# EAGLE design Trigger_Sequencer_Arduino_board (EAGLE 9.2.2)
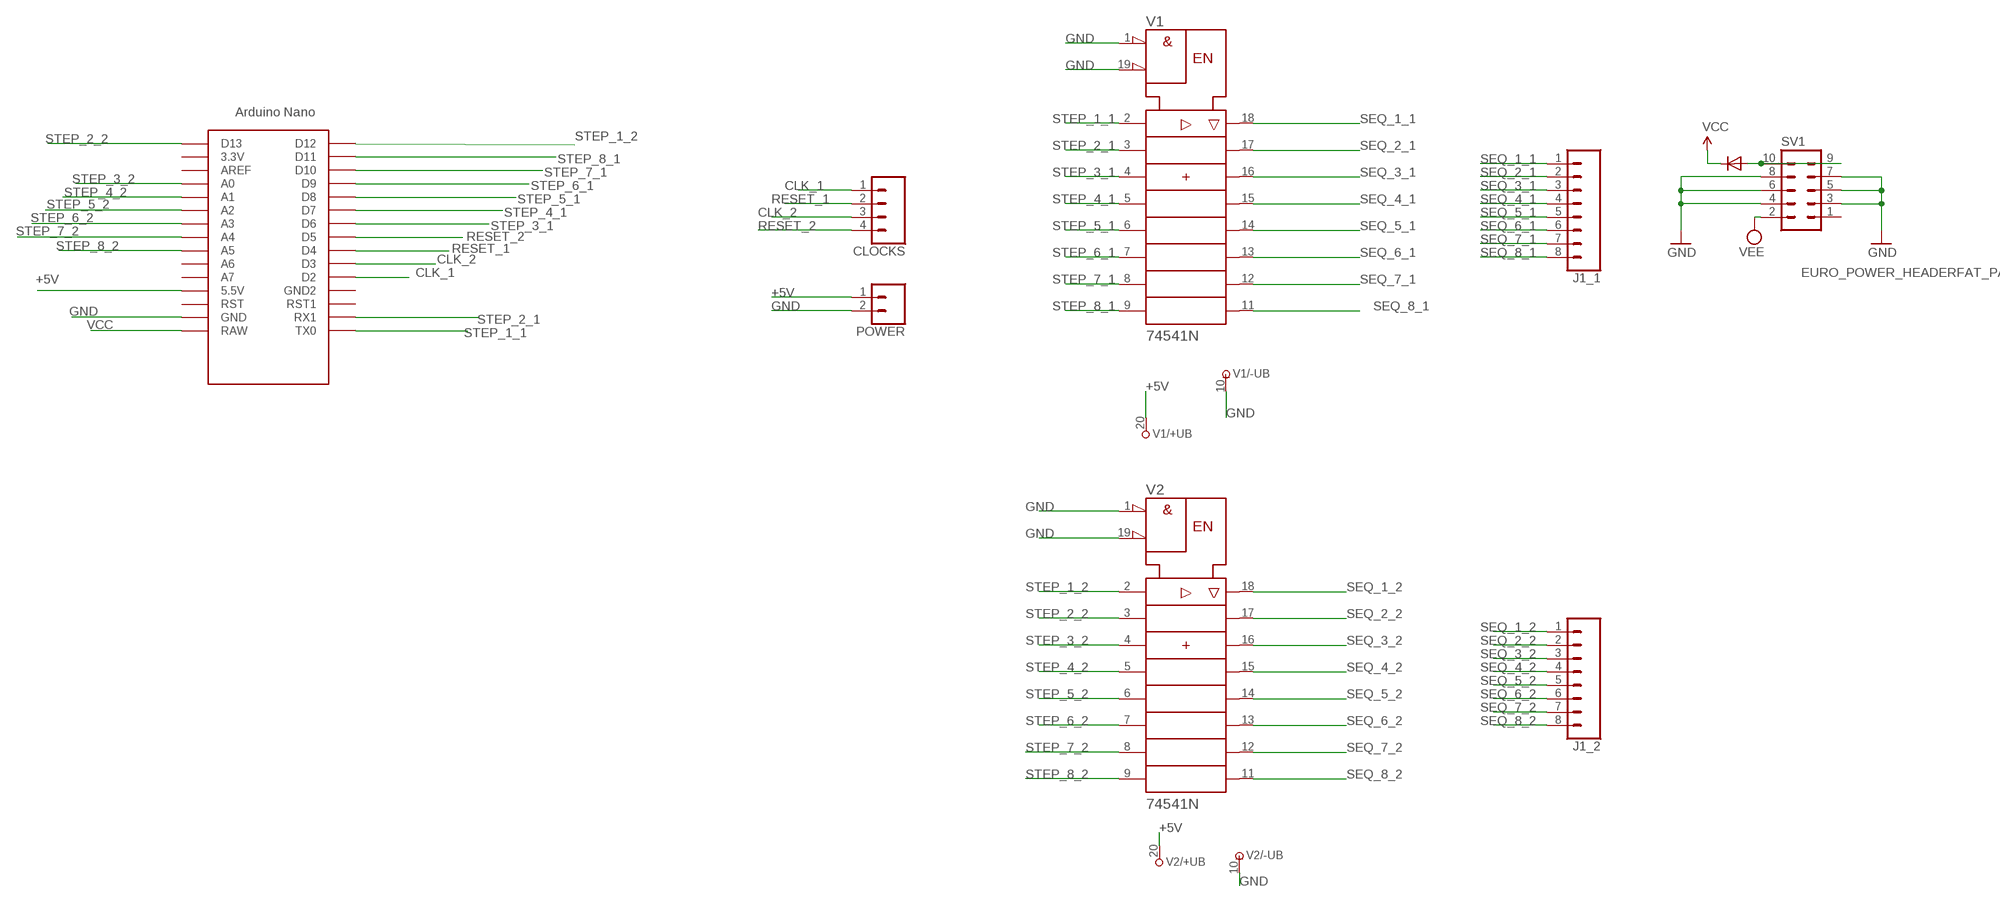
[diagram p0: schematic, sheet 1]

## Parts
CLOCKS  CONN_04  [1X04]
D2  1N5819HW  DIODEDO-1N4148  [DO-1N4148]
J1_1  CONN_08NO_SILK_FEMALE_PTH  [1X08_NO_SILK]
J1_2  CONN_08NO_SILK_FEMALE_PTH  [1X08_NO_SILK]
POWER  CONN_02  [1X02]
SV1  EURO_POWER_HEADERFAT_PADS  [EURO_PWR_HEADER_FAT]
U$1  NANO  [NANO]
V1  74541N  [DIL20]
V2  74541N  [DIL20]

## Nets
+5V: POWER.1 U$1.5V(5.5V) V1.20(+UB) V2.20(+UB)
CLK_1: CLOCKS.1 U$1.D2
CLK_2: CLOCKS.3 U$1.D3
GND: POWER.2 SV1.3 SV1.4 SV1.5 SV1.6 SV1.7 SV1.8 U$1.GND V1.1(!G1) V1.10(-UB) V1.19(!G2) V2.1(!G1) V2.10(-UB) V2.19(!G2)
N$1: D2.A SV1.9 SV1.10
RESET_1: CLOCKS.2 U$1.D4
RESET_2: CLOCKS.4 U$1.D5
SEQ_1_1: J1_1.1 V1.18(Y1)
SEQ_1_2: J1_2.1 V2.18(Y1)
SEQ_2_1: J1_1.2 V1.17(Y2)
SEQ_2_2: J1_2.2 V2.17(Y2)
SEQ_3_1: J1_1.3 V1.16(Y3)
SEQ_3_2: J1_2.3 V2.16(Y3)
SEQ_4_1: J1_1.4 V1.15(Y4)
SEQ_4_2: J1_2.4 V2.15(Y4)
SEQ_5_1: J1_1.5 V1.14(Y5)
SEQ_5_2: J1_2.5 V2.14(Y5)
SEQ_6_1: J1_1.6 V1.13(Y6)
SEQ_6_2: J1_2.6 V2.13(Y6)
SEQ_7_1: J1_1.7 V1.12(Y7)
SEQ_7_2: J1_2.7 V2.12(Y7)
SEQ_8_1: J1_1.8 V1.11(Y8)
SEQ_8_2: J1_2.8 V2.11(Y8)
STEP_1_1: U$1.TX0 V1.2(A1)
STEP_1_2: U$1.D12 V2.2(A1)
STEP_2_1: U$1.RX1 V1.3(A2)
STEP_2_2: U$1.D13 V2.3(A2)
STEP_3_1: U$1.D6 V1.4(A3)
STEP_3_2: U$1.A0 V2.4(A3)
STEP_4_1: U$1.D7 V1.5(A4)
STEP_4_2: U$1.A1 V2.5(A4)
STEP_5_1: U$1.D8 V1.6(A5)
STEP_5_2: U$1.A2 V2.6(A5)
STEP_6_1: U$1.D9 V1.7(A6)
STEP_6_2: U$1.A3 V2.7(A6)
STEP_7_1: U$1.D10 V1.8(A7)
STEP_7_2: U$1.A4 V2.8(A7)
STEP_8_1: U$1.D11 V1.9(A8)
STEP_8_2: U$1.A5 V2.9(A8)
VCC: D2.C U$1.RAW
VEE: SV1.2
Unconnected: SV1.1 U$1.3.3V U$1.A6 U$1.A7 U$1.AREF U$1.GND1(GND2) U$1.RST U$1.RST1

## Library data of the parts
CLOCKS = SparkFun-Connectors:CONN_04: Multi connection point. Often used as Generic Header-pin footprint for 0.1 inch spaced/style header connections On any of the 0.1 inch spaced packages, you can populate with these: Break Away Headers - Straight <https://www.sparkfun.com/products/116> (PRT-00116) Break Away Male Headers - Right Angle <https://www.sparkfun.com/products/553> (PRT-00553) Female Headers <https://www.sparkfun.com/products/115> (PRT-00115) Break Away Headers - Machine Pin <https://www.sparkfun.com/products/117> (PRT-00117) Break Away Female Headers - Swiss Machine Pin <https://www.sparkfun.com/products/743> (PRT-00743) For SCREWTERMINALS and SPRING TERMINALS visit here: Screw Terimnals on SparkFun.com <https://www.sparkfun.com/search/results?term=Screw+Terminals> (5mm/3.5mm/2.54mm spacing) This device is also useful as a general connection point to wire up your design to another part of your project. Our various solder wires solder well into these plated through hole pads. Hook-Up Wire - Assortment (Stranded, 22 AWG) <https://www.sparkfun.com/products/11375> (PRT-11375) Hook-Up Wire - Assortment (Solid Core, 22 AWG) <https://www.sparkfun.com/products/11367> (PRT-11367) View the entire wire category on our website here <https://www.sparkfun.com/categories/141> Special notes: Molex polarized connector foot print use with SKU : PRT-08231 with associated crimp pins and housings. 1MM SMD Version SKU: PRT-10208; PROD_ID: CONN-09696
D2 = adafruit:DIODE: Diode SMADIODE - SMA Surface Mount Package 20V 1A Schottky Diode Digikey: 641-1014-6-ND DO-1N4148 - Through Hole Small Current Diode SOD-123 20V 1 A (.5mV Vf) Schottky Diode - Digikey: MBRX120TPMSCT-ND SOD-323 10V 570mA (.38mV Vf, 3ns) Schottky Diode - Digikey: ZLLS410CT-ND SOD-523 30V 30mA Schottky Diode (RB751S-40TE61) - Digikey: RB751S-40TE61CT-ND SOT23-R/W - SOT23 Package (R = Solder Paste/Reflow Ovens, W = Hand-Soldering) BAT54Film 40V 300mA - Digikey: 497-7162-1-ND
J1_1 J1_2 = SparkFun-Connectors:CONN_08: Multi connection point. Often used as Generic Header-pin footprint for 0.1 inch spaced/style header connections On any of the 0.1 inch spaced packages, you can populate with these: Break Away Headers - Straight <https://www.sparkfun.com/products/116> (PRT-00116) Break Away Male Headers - Right Angle <https://www.sparkfun.com/products/553> (PRT-00553) Female Headers <https://www.sparkfun.com/products/115> (PRT-00115) Break Away Headers - Machine Pin <https://www.sparkfun.com/products/117> (PRT-00117) Break Away Female Headers - Swiss Machine Pin <https://www.sparkfun.com/products/743> (PRT-00743) Arduino Stackable Header - 8 Pin <https://www.sparkfun.com/products/9279> (PRT-09279) For SCREWTERMINALS and SPRING TERMINALS visit here: Screw Terimnals on SparkFun.com <https://www.sparkfun.com/search/results?term=Screw+Terminals> (5mm/3.5mm/2.54mm spacing) This device is also useful as a general connection point to wire up your design to another part of your project. Our various solder wires solder well into these plated through hole pads. Hook-Up Wire - Assortment (Stranded, 22 AWG) <https://www.sparkfun.com/products/11375> (PRT-11375) Hook-Up Wire - Assortment (Solid Core, 22 AWG) <https://www.sparkfun.com/products/11367> (PRT-11367) View the entire wire category on our website here <https://www.sparkfun.com/categories/141> Special notes: Molex polarized connector foot print use with SKU : PRT-08231 with associated crimp pins and housings. 1MM SMD Version SKU: PRT-10208 NOTES ON THE VARIANTS LOCK and LOCK_LONGPADS... This footprint was designed to help hold the alignment of a through-hole component (i.e. 6-pin header) while soldering it into place. You may notice that each hole has been shifted either up or down by 0.005 of an inch from it's more standard position (which is a perfectly straight line). This slight alteration caused the pins (the squares in the middle) to touch the edges of the holes. Because they are alternating, it causes a "brace" to hold the component in place. 0.005 has proven to be the perfect amount of "off-center" position when using our standard breakaway headers. Although looks a little odd when you look at the bare footprint, once you have a header in there, the alteration is very hard to notice. Also,if you push a header all the way into place, it is covered up entirely on the bottom side.; PROD_ID: CONN-08438
POWER = SparkFun-Connectors:CONN_02: Multi connection point. Often used as Generic Header-pin footprint for 0.1 inch spaced/style header connections On any of the 0.1 inch spaced packages, you can populate with these: Break Away Headers - Straight <https://www.sparkfun.com/products/116> (PRT-00116) Break Away Male Headers - Right Angle <https://www.sparkfun.com/products/553> (PRT-00553) Female Headers <https://www.sparkfun.com/products/115> (PRT-00115) Break Away Headers - Machine Pin <https://www.sparkfun.com/products/117> (PRT-00117) Break Away Female Headers - Swiss Machine Pin <https://www.sparkfun.com/products/743> (PRT-00743) For SCREWTERMINALS and SPRING TERMINALS visit here: Screw Terimnals on SparkFun.com <https://www.sparkfun.com/search/results?term=Screw+Terminals> (5mm/3.5mm/2.54mm spacing) This device is also useful as a general connection point to wire up your design to another part of your project. Our various solder wires solder well into these plated through hole pads. Hook-Up Wire - Assortment (Stranded, 22 AWG) <https://www.sparkfun.com/products/11375> (PRT-11375) Hook-Up Wire - Assortment (Solid Core, 22 AWG) <https://www.sparkfun.com/products/11367> (PRT-11367) View the entire wire category on our website here <https://www.sparkfun.com/categories/141> Special notes: Molex polarized connector foot print use with: PRT-08233 with associated crimp pins and housings. 2.54_SCREWTERM for use with PRT-10571. 3.5mm Screw Terminal footprints for PRT-08084 5mm Screw Terminal footprints for use with PRT-08432
SV1 = MusicThingModular:EURO_POWER_HEADER: Power Header 10 pin power header for Eurorack Power Supplies Variants with fatter pads for easier soldering, and the LOCK variant which has 5mil offset pins to hold the component in place before soldering
U$1 = Arduino-clone_EDITED_coordinates:NANO: Arduino Nano
V1 V2 = 74ttl-din:74*541: Octal BUFFER and LINE DRIVER, 3-state

## Board
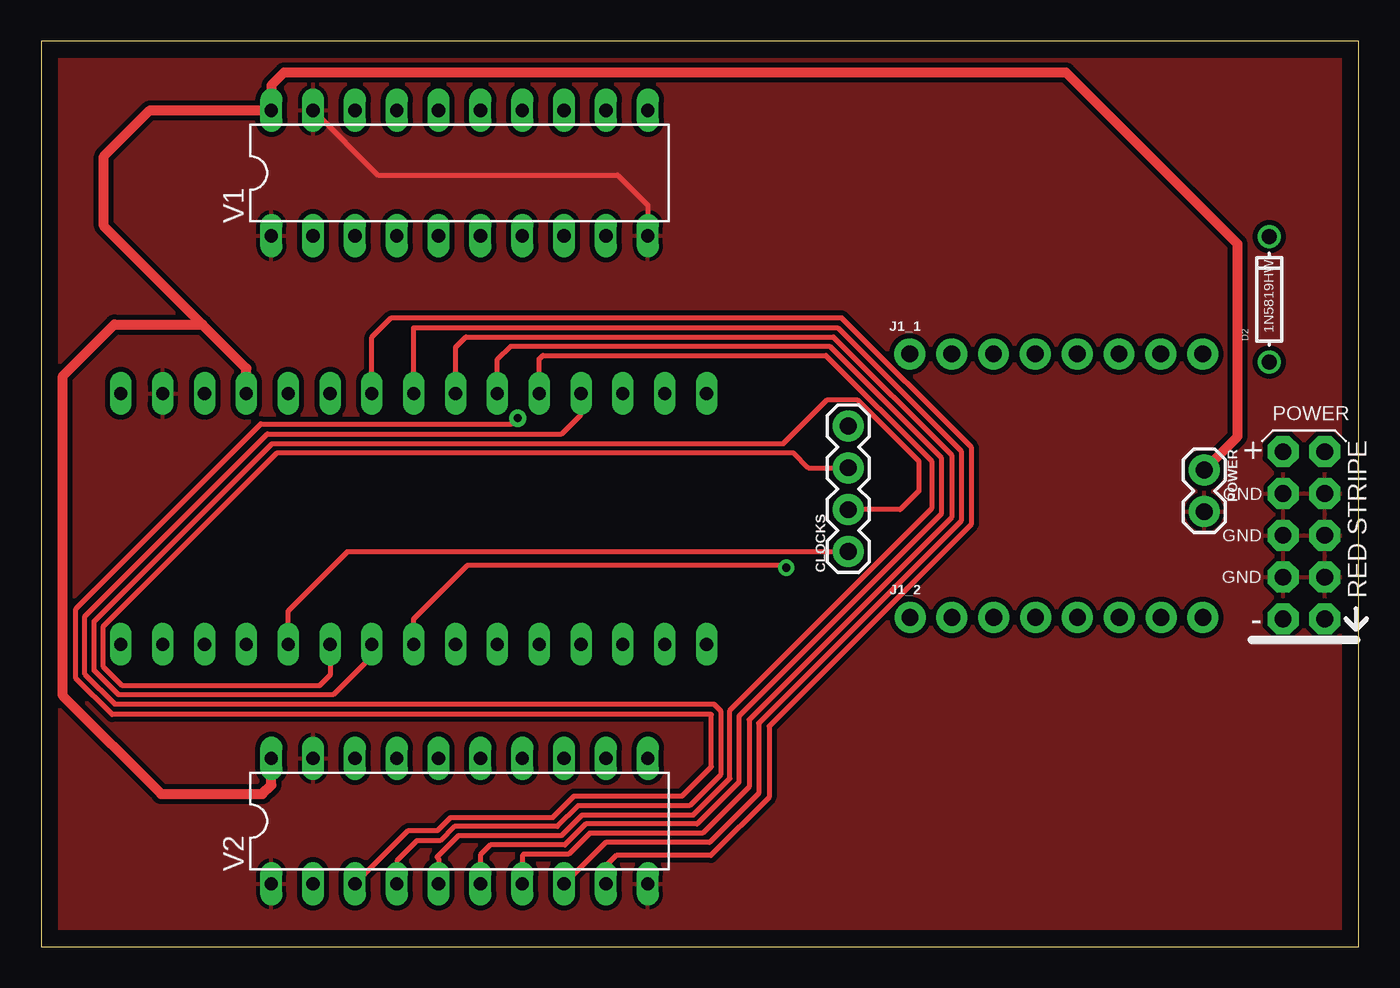
[diagram p1: board, top side]
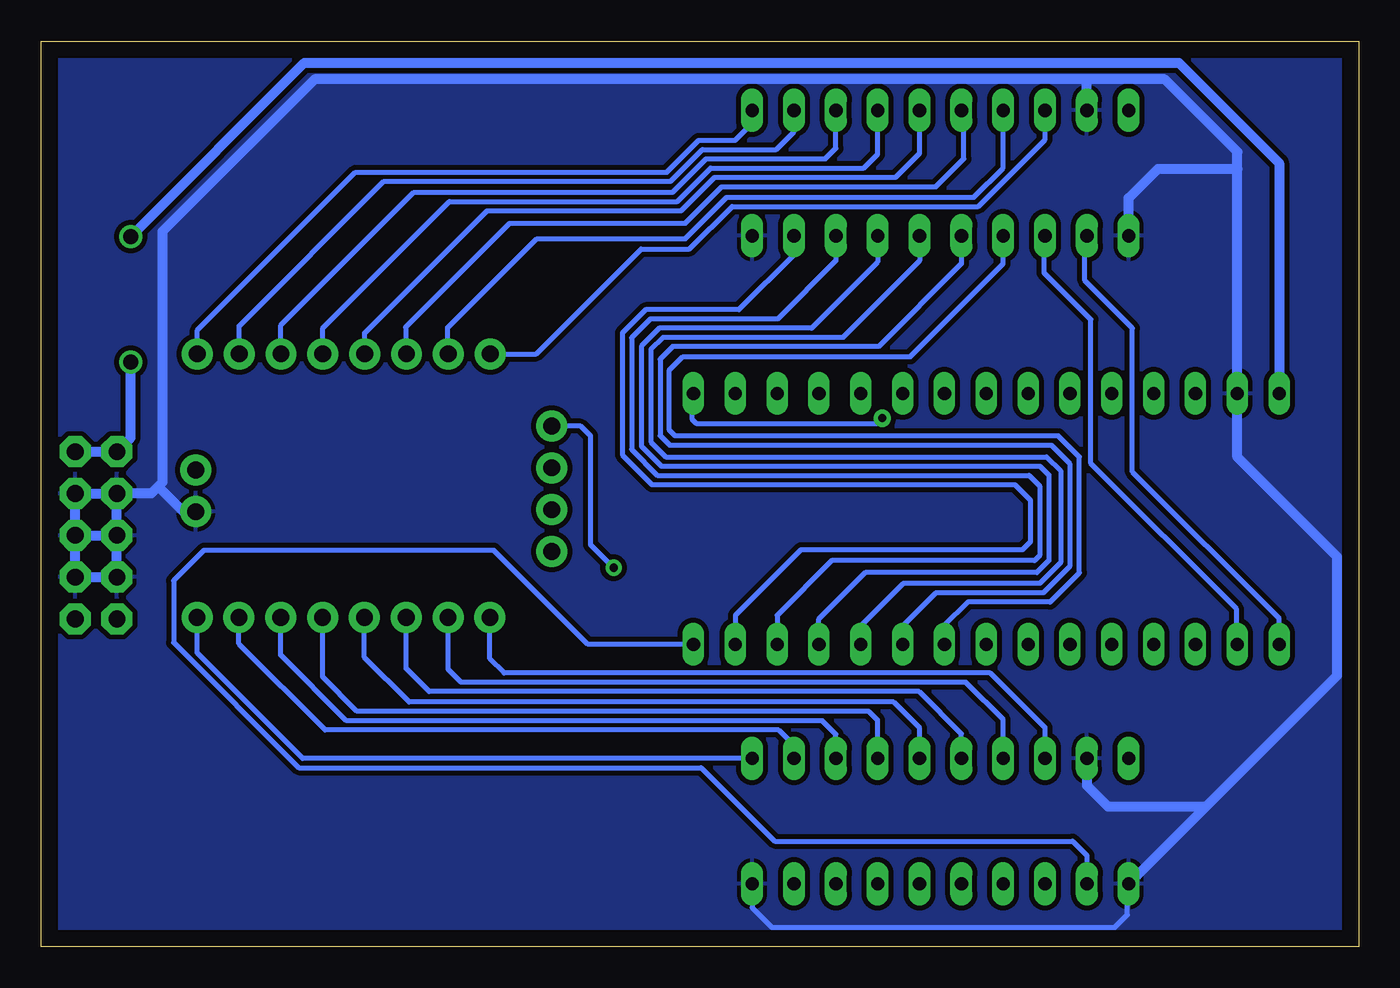
[diagram p2: board, bottom side, seen from below]

Size 80 x 55 mm. Coordinates in mm from the lower left corner, seen from the top.
Outline: 0,0 80,0 80,55 0,55 0,0
Copper layers (1*16): Top 0.035mm / dielectric 1.5mm / Bottom 0.035mm
Design rules "default *": minimum track width 12mil, minimum drill 0.35mm, track to track 10mil, track to pad 10mil, pad to pad 10mil, via to via 10mil, smd to smd 6mil, copper to edge 40mil, drill to drill 10mil, minimum pad ring 10mil, minimum via ring 8mil, stop-mask expansion 4mil, vias tented up to drill 0mil, thermal gap 10mil

### Footprints (pad centres in the part's own frame; a part is rotated, then mirrored left to right if it is on the bottom)
1X04 = drill 1.016 pad 1.88: 1 0,0; 2 2.54,0; 3 5.08,0; 4 7.62,0
DO-1N4148 = drill 0.9: A -3.81,0; C 3.81,0
1X08_NO_SILK = drill 1.016 pad 1.88: 1 0,0; 2 2.54,0; 3 5.08,0; 4 7.62,0; 5 10.16,0; 6 12.7,0; 7 15.24,0; 8 17.78,0
1X02 = drill 1.016 pad 1.88: 1 0,0; 2 2.54,0
EURO_PWR_HEADER_FAT = drill 1.016 pad 1.88 octagon: 1 -5.08,-1.27; 2 -5.08,1.27; 3 -2.54,-1.27; 4 -2.54,1.27; 5 0,-1.27; 6 0,1.27; 7 2.54,-1.27; 8 2.54,1.27; 9 5.08,-1.27; 10 5.08,1.27
NANO = drill 0.8 long: 3.3V 0,33.02; 5V 0,7.62; A0 0,27.94; A1 0,25.4; A2 0,22.86; A3 0,20.32; A4 0,17.78; A5 0,15.24; A6 0,12.7; A7 0,10.16; AREF 0,30.48; D2 15.24,10.16; D3 15.24,12.7; D4 15.24,15.24; D5 15.24,17.78; D6 15.24,20.32; D7 15.24,22.86; D8 15.24,25.4; D9 15.24,27.94; D10 15.24,30.48; D11 15.24,33.02; D12 15.24,35.56; D13 0,35.56; GND 0,2.54; GND1 15.24,7.62; RAW 0,0; RST 0,5.08; RST1 15.24,5.08; RX1 15.24,2.54; TX0 15.24,0
DIL20 = drill 0.813 long: 1 -11.43,-3.81; 2 -8.89,-3.81; 3 -6.35,-3.81; 4 -3.81,-3.81; 5 -1.27,-3.81; 6 1.27,-3.81; 7 3.81,-3.81; 8 6.35,-3.81; 9 8.89,-3.81; 10 11.43,-3.81; 11 11.43,3.81; 12 8.89,3.81; 13 6.35,3.81; 14 3.81,3.81; 15 1.27,3.81; 16 -1.27,3.81; 17 -3.81,3.81; 18 -6.35,3.81; 19 -8.89,3.81; 20 -11.43,3.81

### Placement (x,y rotation side)
CLOCKS  49,24 90 top
D2  74.56,39.32 90 top
J1_1  52.74,36 0 top
J1_2  52.76,20 0 top
POWER  70.61,28.96 270 top
SV1  76.67,24.98 90 top
U$1  4.84,33.6 270 top
V1  25.4,46.99 0 top
V2  25.4,7.62 0 top

### Tracks (layer width: path | path; a pad name or v marks a point on that pad's centre or on a via)
+5V
  Top 0.61: U$1.5V 12.46,35.12 9.78,37.8 | 9.78,37.8 3.81,43.77 3.81,48.01 6.6,50.8 V1.20 13.97,52.32 14.73,53.09 62.23,53.09 72.64,42.67 72.64,30.99 POWER.1 | V2.20 13.97,9.8 13.44,9.27 7.29,9.27 1.32,15.24 1.32,34.67 4.45,37.8 9.78,37.8
CLK_1
  Top 0.305: U$1.D2 15,20.39 18.61,24 CLOCKS.1
CLK_2
  Top 0.305: U$1.D3 17.54,16.5 16.89,15.85 4.93,15.85 3.78,17 3.78,19.45 14.3,29.97 45.7,29.97 46.59,29.08 CLOCKS.3
GND
  Top 0.305: V1.19 20.45,46.86 35,46.86 36.83,45.03 V1.10
  Bottom 0.305: V2.10 36.83,2.36 35.64,1.17 14.81,1.17 14.05,1.93 14.05,3.73 V2.1
  Bottom 0.61: SV1.8 SV1.7 SV1.5 | SV1.5 SV1.6 | SV1.6 SV1.4 SV1.3 SV1.5 | SV1.6 SV1.8 | 7.38,47.24 U$1.GND 7.38,29.73 1.32,23.67 1.32,16.46 9.27,8.51 | 7.38,47.24 7.38,48.27 11.79,52.68 16.51,52.68 | 16.51,52.68 63.4,52.68 72.64,43.43 72.64,28.19 72.9,27.94 | 72.9,27.94 73.31,27.52 SV1.8 | V1.1 13.97,45.47 12.19,47.24 7.38,47.24 | V2.1 9.27,8.51 | V2.19 16.51,9.78 15.24,8.51 9.27,8.51 | V1.19 16.51,52.68 | POWER.2 71.37,26.42 72.9,27.94
  pour Top (isolate 0.305): 0,0 0,54.86 80.01,54.86 80.01,0
  pour Bottom (isolate 0.305): 0,0 0,54.86 80.01,54.86 80.01,0
N$1
  Bottom 0.61: D2.A 74.56,30.9 SV1.10 SV1.9
RESET_1
  Top 0.305: U$1.D4 20.08,17.64 17.73,15.29 4.7,15.29 3.22,16.77 3.22,19.76 14.02,30.55 45.06,30.55 47.73,33.22 49.55,33.22 53.28,29.48 53.28,27.67 52.15,26.54 CLOCKS.2
RESET_2  (via drill 0.5 pad 1)
  Top 0.305: U$1.D5 22.62,19.9 25.88,23.16 45.09,23.16 v45.24,23.01
  Bottom 0.305: v45.24,23.01 46.63,24.41 46.63,31.01 47.24,31.62 CLOCKS.4
SEQ_1_1
  Bottom 0.305: J1_1.1 49.95,36 43.58,42.37 40.64,42.37 38.05,44.96 23.11,44.96 19.05,49.02 V1.18
SEQ_1_2
  Bottom 0.305: V2.18 19.05,13.29 22.38,16.61 51.89,16.61 52.76,17.48 J1_2.1
SEQ_2_1
  Bottom 0.305: J1_1.2 55.33,36.05 55.33,37.58 49.9,43 40.89,43 38.38,45.52 23.37,45.52 21.59,47.3 V1.17
SEQ_2_2
  Bottom 0.305: V2.17 21.59,13.79 23.85,16.05 54.51,16.05 55.3,16.84 J1_2.2
SEQ_3_1
  Bottom 0.305: J1_1.3 57.87,36.05 57.87,37.63 51.55,43.94 40.89,43.94 38.68,46.15 25.68,46.15 23.98,47.85 23.98,50.65 V1.16
SEQ_3_2
  Bottom 0.305: V2.16 24.13,12.93 26.7,15.49 56.44,15.49 57.84,16.89 J1_2.3
SEQ_4_1
  Bottom 0.305: J1_1.4 60.36,37.27 52.93,44.7 41.15,44.7 39.12,46.74 28.12,46.74 26.67,48.18 V1.15
SEQ_4_2
  Bottom 0.305: V2.15 26.67,13.28 28.25,14.86 57.66,14.86 60.38,17.58 J1_2.4
SEQ_5_1
  Bottom 0.305: J1_1.5 62.9,37.58 55.21,45.26 41.38,45.26 39.35,47.3 30.05,47.3 29.21,48.13 V1.14
SEQ_5_2
  Bottom 0.305: V2.14 29.21,13.74 29.77,14.3 60.83,14.3 62.92,16.38 J1_2.5
SEQ_6_1
  Bottom 0.305: J1_1.6 65.44,37.75 57.37,45.82 41.66,45.82 39.62,47.85 32.38,47.85 31.75,48.49 V1.13
SEQ_6_2
  Bottom 0.305: V2.13 31.75,12.9 32.56,13.72 61.47,13.72 65.46,17.7 J1_2.6
SEQ_7_1
  Bottom 0.305: J1_1.7 67.98,37.7 59.2,46.48 41.79,46.48 39.85,48.41 35.38,48.41 34.29,49.51 V1.12
SEQ_7_2
  Bottom 0.305: V2.12 34.29,12.22 35.23,13.16 62.75,13.16 68,18.4 J1_2.7
SEQ_8_1
  Bottom 0.305: J1_1.8 70.52,37.45 60.93,47.04 42.02,47.04 40.09,48.97 37.87,48.97 36.83,50.01 V1.11
SEQ_8_2
  Bottom 0.305: V2.11 64.12,11.43 70.54,17.84 J1_2.8
STEP_1_1
  Bottom 0.305: U$1.TX0 4.84,19.93 13.74,28.83 13.74,37.57 16.64,40.46 16.64,43.05 V1.2
STEP_1_2
  Bottom 0.305: U$1.D12 46.81,18.36 52.52,24.06 70.13,24.06 71.96,22.23 71.96,18.47 64.36,10.87 39.93,10.87 35.46,6.4 17.37,6.4 16.51,5.54 V2.2
STEP_2_1
  Bottom 0.305: V1.3 19.1,43.13 19.1,40.92 16.27,38.09 16.27,29.36 7.42,20.5 7.42,18.39 U$1.RX1
STEP_2_2  (via drill 0.5 pad 1.05)
  Top 0.305: V2.3 22.3,7.06 24.07,7.06 24.86,7.85 31.06,7.85 32.36,9.14 38.91,9.14 40.69,10.92 40.69,14.09 4.31,14.09 2.1,16.3 2.1,20.52 13.33,31.75 13.34,31.75 28.58,31.75 v28.93,32.1
  Bottom 0.305: v28.93,32.1 29.25,31.78 40.24,31.78 40.46,32 40.46,33.53 U$1.D13
STEP_3_1
  Bottom 0.305: V1.4 21.59,41.48 27.23,35.84 41.05,35.84 41.87,35.02 41.87,31.37 41.51,31.02 18.24,31.02 16.97,29.74 16.97,22.71 18.75,20.93 23.75,20.93 25.16,19.52 U$1.D6
STEP_3_2
  Top 0.305: V2.4 21.59,5.21 22.81,6.43 24.23,6.43 25.09,7.29 31.34,7.29 32.6,8.56 39.36,8.56 41.25,10.45 41.25,14.33 40.84,14.73 4.46,14.73 2.66,16.54 2.66,20.07 13.73,31.14 31.59,31.14 32.78,32.32 U$1.A0
STEP_4_1
  Bottom 0.305: V1.5 24.13,41.48 29.16,36.45 41.66,36.45 42.42,35.68 42.42,31.04 41.84,30.45 18.67,30.45 17.55,29.34 17.55,23.09 19.15,21.49 25.68,21.49 27.7,19.47 U$1.D7
STEP_4_2
  Top 0.305: U$1.A1 30.24,35.7 30.45,35.92 47.64,35.92 54.07,29.49 54.07,26.6 41.81,14.34 41.81,10.21 39.6,8 32.84,8 31.57,6.73 25.32,6.73 24.03,5.44 24.13,5.33 V2.5
STEP_5_1
  Bottom 0.305: V1.6 26.67,41.66 31.32,37.01 42.25,37.01 42.98,36.27 42.98,30.66 42.07,29.74 18.95,29.74 18.11,28.91 18.11,23.32 19.37,22.06 27.65,22.06 30.24,19.47 U$1.D8
STEP_5_2
  Top 0.305: U$1.A2 27.7,35.67 28.5,36.47 47.87,36.47 54.65,29.7 54.65,26.26 42.37,13.98 42.37,9.98 39.83,7.44 33.07,7.44 31.8,6.17 27.28,6.17 26.67,5.56 V2.6
STEP_6_1
  Bottom 0.305: V1.7 29.21,41.58 33.22,37.57 42.48,37.57 43.57,36.48 43.57,30.4 42.35,29.18 19.36,29.18 18.82,28.65 18.82,23.45 19.55,22.72 29.96,22.72 32.82,19.86 32.82,18.39 U$1.D9
STEP_6_2
  Top 0.305: U$1.A3 25.16,36.41 25.78,37.03 48.1,37.03 55.28,29.86 55.28,26.08 42.98,13.77 42.98,9.7 40.16,6.88 33.3,6.88 32.03,5.61 29.29,5.61 29.21,5.54 V2.7
STEP_7_1
  Bottom 0.305: V1.8 31.75,41.66 35.28,38.12 43.01,38.12 44.15,36.99 44.15,30.2 42.58,28.63 20.02,28.63 19.38,27.99 19.38,23.75 19.68,23.44 32,23.44 35.32,20.13 U$1.D10
STEP_7_2
  Top 0.305: U$1.A4 22.62,37.59 48.36,37.59 55.85,30.1 55.85,25.86 43.56,13.57 43.56,9.3 40.58,6.33 34.27,6.33 V2.8
STEP_8_1
  Bottom 0.305: V1.9 34.29,42.04 37.64,38.68 43.3,38.68 44.71,37.27 44.71,29.86 42.91,28.07 20.88,28.07 19.94,27.13 19.94,24.59 20.42,24.11 33.88,24.11 37.86,20.13 U$1.D11
STEP_8_2
  Top 0.305: U$1.A5 20.08,37.02 21.26,38.2 48.59,38.2 56.49,30.3 56.49,25.68 44.2,13.39 44.2,9.07 40.66,5.54 34.92,5.54 34.29,4.9 V2.9
VCC
  Bottom 0.61: D2.C 64.02,53.68 10.92,53.68 4.84,47.59 U$1.RAW